# Altium schematic sheet Sensors_modules.SchDoc
size 209 x 297 mm; SheetNumber: 3; SheetTotal: 3
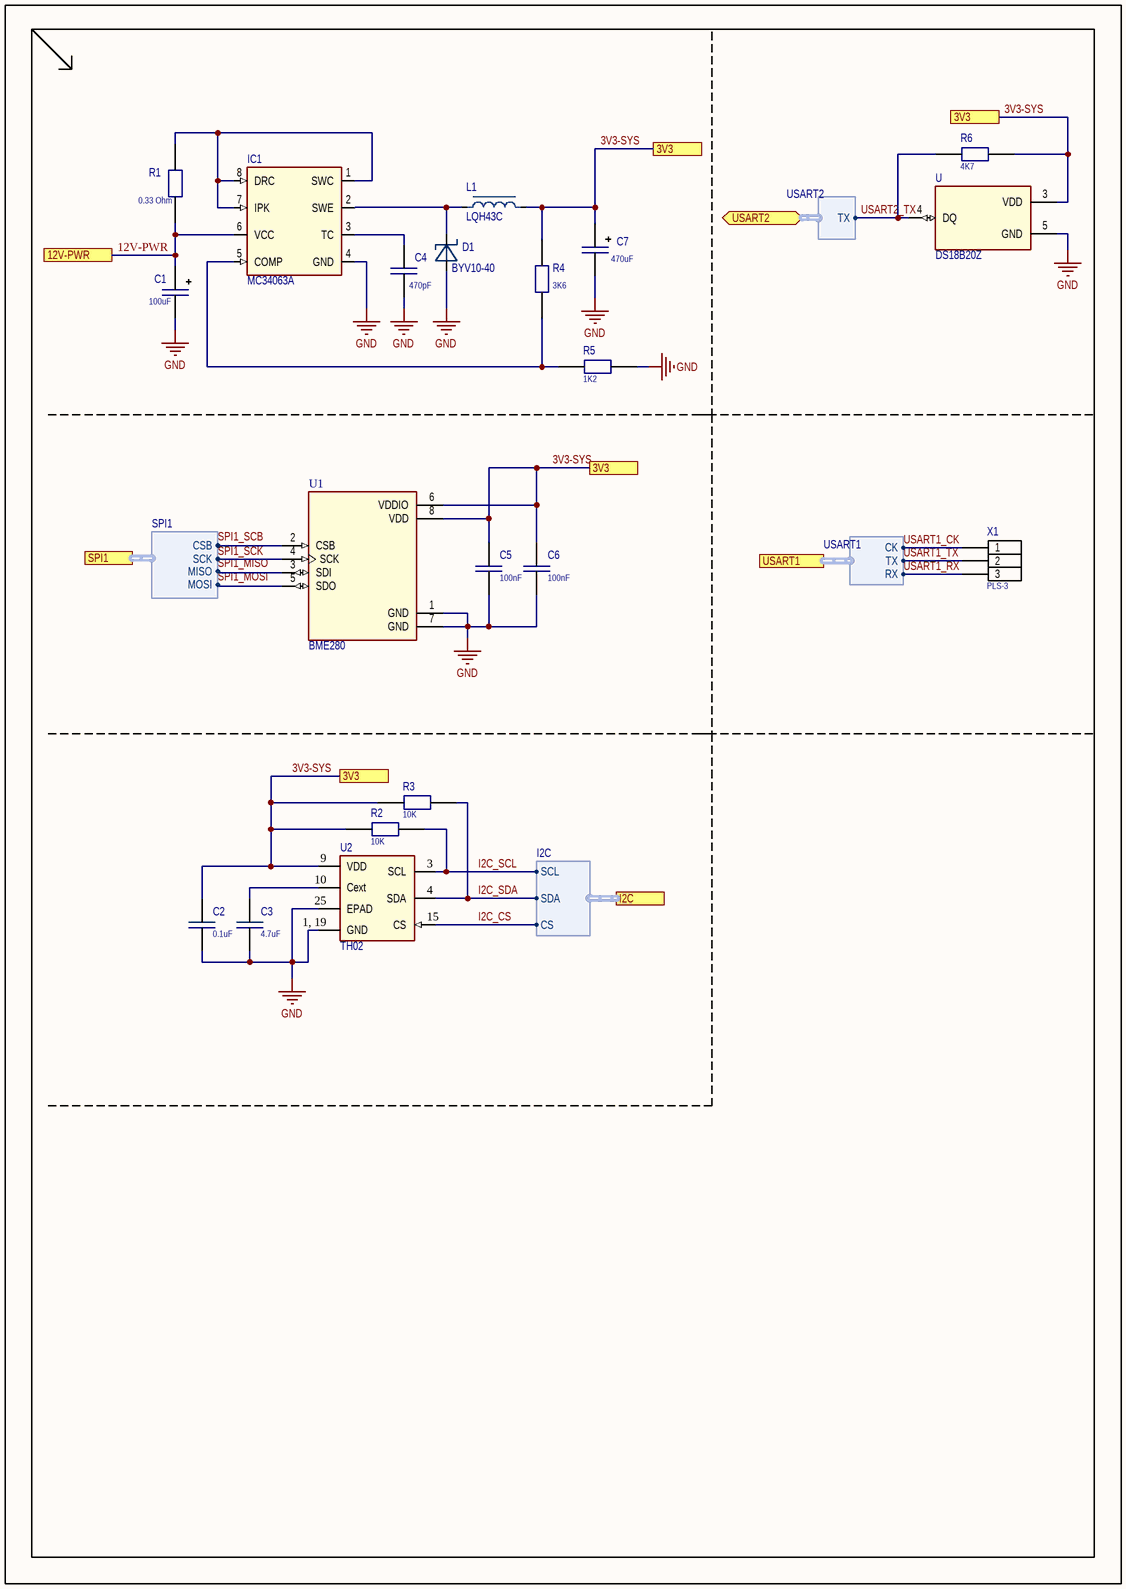
[diagram p0: Sensors_modules.SchDoc]

## Parts
C1  100uF  [CPM6032]
C2  0.1uF  [C_0805]
C3  4.7uF  [C_0805]
C4  470pF  [C_0805]
C5  100nF  [C_0805]
C6  100nF  [C_0805]
C7  470uF  [CPM6032]
D1  BYV10-40  [BYV10-40]
IC1  MC34063A  [SO08]
L1  LQH43C  [IND_LQH43CN2R2M03L]
R1  0.33 Ohm  [R_0402]
R2  10K  [R_0402]
R3  10K  [R_0402]
R4  3K6  [R_0402]
R5  1K2  [R_0402]
R6  4K7  [R_0402]
U  DS18B20Z  [SOIC127P600X175-8N]
U1  BME280  [PSON65P250X250X100-8N]
U2  TH02  [QFN-24]
X1  PLS-3  [PLS-3-3D]

## Ports
3V3, 12V-PWR, I2C (harness I2C), SPI1 (harness SPI1), USART1 (harness USART1), USART2 (bidir, harness USART2)

## Harnesses
SPI1: CSB, SCK, MISO, MOSI
USART1: TX, RX, CK
I2C: SCL, SDA, CS
USART2: TX

## Nets
GND: C1.1 C2.1 C3.1 C4.1 C5.1 C6.1 C7.1 D1.2 IC1.4(GND) R5.1 U.5(GND) U1.1(GND) U1.7(GND) U2.1,_19(GND) U2.25(EPAD)
3V3-SYS: C2.2 C5.2 C6.2 C7.2 L1.2 R2.2 R3.2 R4.2 R6.1 U.3(VDD) U1.6(VDDIO) U1.8(VDD) U2.9(VDD) ; port 3V3
12V-PWR: C1.2 IC1.6(VCC) R1.1 ; port 12V-PWR
I2C_CS: U2.15(CS) ; port I2C.CS
I2C_SCL: R2.1 U2.3(SCL) ; port I2C.SCL
I2C_SDA: R3.1 U2.4(SDA) ; port I2C.SDA
SPI1_MISO: U1.3(SDI) ; port SPI1.MISO
SPI1_MOSI: U1.5(SDO) ; port SPI1.MOSI
SPI1_SCB: U1.2(CSB)
SPI1_SCK: U1.4(SCK) ; port SPI1.SCK
USART1_CK: X1.1 ; port USART1.CK
USART1_RX: X1.3 ; port USART1.RX
USART1_TX: X1.2 ; port USART1.TX
USART2_TX: R6.2 U.4(DQ) ; port USART2.TX
NetC3_2: C3.2 U2.10(Cext)
NetC4_2: C4.2 IC1.3(TC)
NetD1_1: D1.1 IC1.2(SWE) L1.1
NetIC1_1: IC1.1(SWC) IC1.7(IPK) IC1.8(DRC) R1.2
NetIC1_5: IC1.5(COMP) R4.1 R5.2

## Library data of the parts
C1 C7 = CPM6032: Capacitor
  C1: Value: 100uF
  C7: Value: 470uF
C2-C6 = C0805: Capacitor
  C2: Value: 0.1uF
  C3: Value: 4.7uF
  C4: Value: 470pF
  C5 C6: Value: 100nF
D1 = BYV10-40: Diode Schottky
IC1 = MC34063A: Buck, Boost Switching Regulator IC Positive or Negative Adjustable 1.25V 1 Output 1.5A _Switch_ 8-SOIC _0.154, 3.90mm Width_; MF: Texas Instruments; Package: SOIC-8 Texas Instruments; MP: MC34063A; Availability: Unavailable; Price: None; Value: *; SnapEDA_Link: https://www.snapeda.com/parts/MC34063A/Texas%20Instruments/view-part/581314/?ref=snap
L1 = LQH43C: Inductor with Inductance: 2.2uH Tol. +/-20%, Package: 1812 (4532); MP: LQH43CN2R2M03L; MF: Murata; Package: NONSTANDARD; SnapEDA_Link: https://www.snapeda.com/parts/LQH43CN2R2M03L/Murata/view-part/4550537/?ref=snap; Purchase-URL: https://pricing.snapeda.com/search/part/LQH43CN2R2M03L/?ref=eda; Price: None; Value: *; Availability: Good
R1-R6 = R0402: Resistor
  R1: Value: 0.33 Ohm
  R2 R3: Value: 10K
  R4: Value: 3K6
  R5: Value: 1K2
  R6: Value: 4K7
U = DS18B20Z: Temperature Sensor Digital, Local -55Â°C ~ 125Â°C 12 b 8-SOIC; MP: DS18B20Z+; MF: Maxim Integrated; Availability: Unavailable; SnapEDA_Link: https://www.snapeda.com/parts/DS18B20Z%2B/Maxim%20Integrated/view-part/109391/?ref=snap; Value: *; Package: SOIC-8 Maxim; Price: None
U1 = BME280: DIGITAL HUMIDITY, PRESSURE AND TEMPERATURE SENSOR<br>* Digital interface IÂ²C (up to 3.4 MHz) and SPI (3 and 4 wire, up to 10 MHz)* Supply voltage VDD main supply voltage range: 1.71 V to 3.6 V*VDDIO interface voltage range: 1.2 V to 3.6 V<br> Operating range -40â€¦+85 Â°C, 0â€¦100 % rel. humidity, 300â€¦1100 hPa <br><br>  The library has been designed by<a href="https://www.facebook.com/groups/eaglecadsoftUK"> Richard Magdycz</a>; Package: None; Availability: Unavailable; MP: BME280; Value: *; Price: None
X1 = PLS-3: Header, 3-Pin; LatestRevisionDate: 17-Jul-2002; LatestRevisionNote: Re-released for DXP Platform.; Publisher: Altium Limited